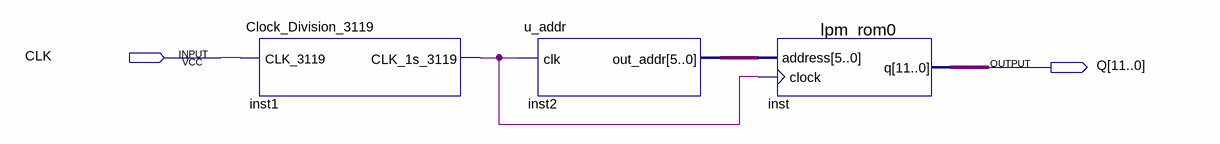
[diagram p0: schematic sheet]
// Quartus schematic aa.bdf as structural Verilog: 3 symbols, 2 pins
module aa (
  input  CLK,
  output [11:0] Q
);

  wire inst1_clk_1s_3119;
  wire [5:0] inst2_out_addr;

  Clock_Division_3119 inst1 (.CLK_3119(CLK), .CLK_1s_3119(inst1_clk_1s_3119));
  u_addr inst2 (.clk(inst1_clk_1s_3119), .out_addr(inst2_out_addr));
  lpm_rom0 inst (.address(inst2_out_addr), .clock(inst1_clk_1s_3119), .q(Q));
endmodule
